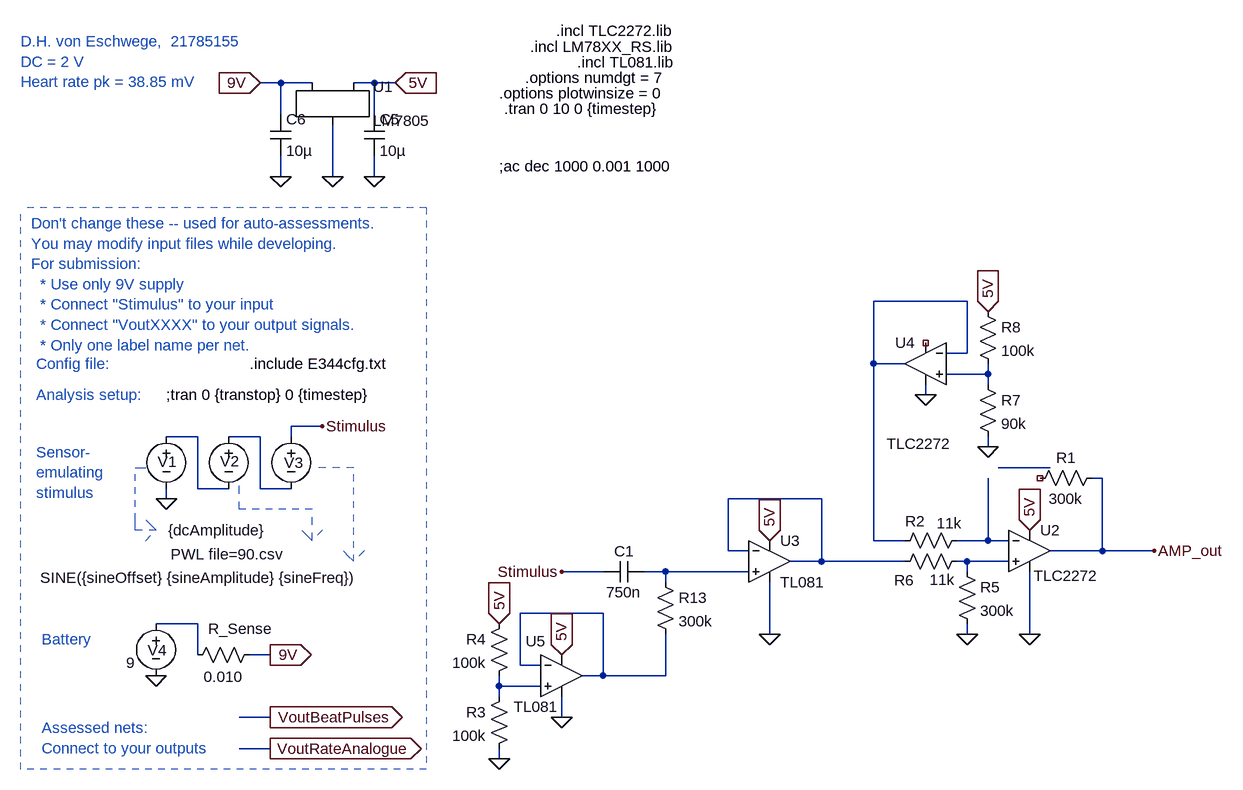
[diagram p0: schematic X_exp_2.asc]
X_exp_2.asc, the LTspice schematic file:
Version 4
SHEET 1 1824 680
WIRE -1904 -1600 -1936 -1600
WIRE -1856 -1600 -1904 -1600
WIRE -1760 -1600 -1792 -1600
WIRE -1728 -1600 -1760 -1600
WIRE -1904 -1552 -1904 -1600
WIRE -1760 -1552 -1760 -1600
WIRE -1904 -1456 -1904 -1488
WIRE -1824 -1456 -1824 -1536
WIRE -1760 -1456 -1760 -1488
WIRE -848 -1264 -992 -1264
WIRE -848 -1184 -848 -1264
WIRE -848 -1184 -880 -1184
WIRE -992 -1168 -992 -1264
WIRE -944 -1168 -992 -1168
WIRE -816 -1152 -816 -1168
WIRE -816 -1152 -880 -1152
WIRE -816 -1136 -816 -1152
WIRE -912 -1120 -912 -1136
WIRE -1840 -1072 -1888 -1072
WIRE -2032 -1056 -2080 -1056
WIRE -1936 -1056 -1984 -1056
WIRE -1888 -1056 -1888 -1072
WIRE -816 -1040 -816 -1056
WIRE -720 -1008 -800 -1008
WIRE -640 -992 -656 -992
WIRE -2032 -976 -2032 -1056
WIRE -1984 -976 -2032 -976
WIRE -1936 -976 -1936 -1056
WIRE -1888 -976 -1936 -976
WIRE -2080 -960 -2080 -976
WIRE -1072 -960 -1216 -960
WIRE -992 -896 -992 -1168
WIRE -944 -896 -992 -896
WIRE -816 -896 -816 -992
WIRE -816 -896 -864 -896
WIRE -784 -896 -816 -896
WIRE -1216 -880 -1216 -960
WIRE -1184 -880 -1216 -880
WIRE -640 -880 -640 -992
WIRE -640 -880 -720 -880
WIRE -560 -880 -640 -880
WIRE -1072 -864 -1072 -960
WIRE -1072 -864 -1120 -864
WIRE -944 -864 -1072 -864
WIRE -848 -864 -864 -864
WIRE -784 -864 -848 -864
WIRE -1408 -848 -1472 -848
WIRE -1312 -848 -1344 -848
WIRE -1184 -848 -1312 -848
WIRE -848 -848 -848 -864
WIRE -1312 -832 -1312 -848
WIRE -1408 -784 -1536 -784
WIRE -2032 -768 -2096 -768
WIRE -1152 -752 -1152 -832
WIRE -848 -752 -848 -768
WIRE -752 -752 -752 -848
WIRE -2032 -720 -2032 -768
WIRE -1920 -720 -1952 -720
WIRE -1536 -704 -1536 -784
WIRE -1504 -704 -1536 -704
WIRE -1408 -688 -1408 -784
WIRE -1408 -688 -1440 -688
WIRE -1312 -688 -1312 -752
WIRE -1312 -688 -1408 -688
WIRE -1568 -672 -1568 -688
WIRE -1504 -672 -1568 -672
WIRE -1568 -656 -1568 -672
WIRE -1920 -624 -1968 -624
WIRE -1472 -624 -1472 -656
WIRE -1920 -576 -1968 -576
WIRE -1568 -560 -1568 -576
FLAG -2080 -960 0
FLAG -1840 -1072 Stimulus
FLAG -1920 -720 9V
IOPIN -1920 -720 Out
FLAG -2096 -688 0
FLAG -1920 -624 VoutBeatPulses
IOPIN -1920 -624 Out
FLAG -1920 -576 VoutRateAnalogue
IOPIN -1920 -576 Out
FLAG -1824 -1456 0
FLAG -1152 -752 0
FLAG -1936 -1600 9V
IOPIN -1936 -1600 In
FLAG -1904 -1456 0
FLAG -1760 -1456 0
FLAG -1728 -1600 5V
IOPIN -1728 -1600 In
FLAG -1152 -896 5V
IOPIN -1152 -896 In
FLAG -1568 -560 0
FLAG -1568 -768 5V
IOPIN -1568 -768 In
FLAG -1472 -624 0
FLAG -1472 -720 5V
IOPIN -1472 -720 In
FLAG -1472 -848 Stimulus
FLAG -752 -752 0
FLAG -848 -752 0
FLAG -816 -1040 0
FLAG -816 -1248 5V
IOPIN -816 -1248 In
FLAG -752 -912 5V
IOPIN -752 -912 In
FLAG -560 -880 AMP_out
FLAG -912 -1120 0
SYMBOL voltage -1984 -1072 R0
WINDOW 123 0 0 Left 0
WINDOW 39 0 0 Left 0
WINDOW 3 -89 197 Left 2
WINDOW 0 -13 54 Left 2
SYMATTR Value PWL file=90.csv
SYMATTR InstName V2
SYMBOL voltage -1888 -1072 R0
WINDOW 123 24 44 Left 2
WINDOW 39 0 0 Left 0
WINDOW 3 -386 233 Left 2
WINDOW 0 -11 56 Left 2
SYMATTR Value SINE({sineOffset} {sineAmplitude} {sineFreq})
SYMATTR InstName V3
SYMBOL voltage -2080 -1072 R0
WINDOW 123 0 0 Left 0
WINDOW 39 0 0 Left 0
WINDOW 3 3 160 Left 2
WINDOW 0 -13 55 Left 2
SYMATTR Value {dcAmplitude}
SYMATTR InstName V1
SYMBOL voltage -2096 -784 R0
WINDOW 123 24 44 Left 2
WINDOW 39 0 0 Left 0
WINDOW 3 -46 76 Left 2
WINDOW 0 -13 57 Left 2
SYMATTR Value 9
SYMATTR InstName V4
SYMBOL res -1936 -736 R90
WINDOW 0 -9 30 VBottom 2
WINDOW 3 34 56 VTop 2
SYMATTR InstName R_Sense
SYMATTR Value 0.010
SYMBOL LM7805 -1824 -1584 R0
SYMATTR InstName U1
SYMBOL Opamps\\opamp2 -1152 -928 R0
SYMATTR InstName U3
SYMATTR Value TL081
SYMBOL cap -1776 -1552 R0
SYMATTR InstName C5
SYMATTR Value 10µ
SYMBOL cap -1920 -1552 R0
SYMATTR InstName C6
SYMATTR Value 10µ
SYMBOL cap -1344 -864 R90
WINDOW 0 0 32 VBottom 2
WINDOW 3 32 32 VTop 2
SYMATTR InstName C1
SYMATTR Value 750n
SYMBOL res -1552 -672 M0
SYMATTR InstName R3
SYMATTR Value 100k
SYMBOL res -1552 -784 M0
SYMATTR InstName R4
SYMATTR Value 100k
SYMBOL Opamps\\opamp2 -1472 -752 R0
WINDOW 0 -55 11 Left 2
WINDOW 3 -74 112 Left 2
SYMATTR InstName U5
SYMATTR Value TL081
SYMBOL res -1328 -848 R0
SYMATTR InstName R13
SYMATTR Value 300k
SYMBOL res -640 -1008 R90
WINDOW 0 0 56 VBottom 2
WINDOW 3 32 56 VTop 2
SYMATTR InstName R1
SYMATTR Value 300k
SYMBOL res -848 -912 R90
WINDOW 0 2 80 VBottom 2
WINDOW 3 -26 27 VTop 2
SYMATTR InstName R2
SYMATTR Value 11k
SYMBOL Opamps\\opamp2 -752 -944 R0
WINDOW 3 6 102 Left 2
SYMATTR Value TLC2272
SYMATTR InstName U2
SYMBOL res -864 -864 R0
SYMATTR InstName R5
SYMATTR Value 300k
SYMBOL res -848 -880 R90
WINDOW 0 61 97 VBottom 2
WINDOW 3 29 38 VTop 2
SYMATTR InstName R6
SYMATTR Value 11k
SYMBOL res -832 -1152 R0
SYMATTR InstName R7
SYMATTR Value 90k
SYMBOL res -832 -1264 R0
SYMATTR InstName R8
SYMATTR Value 100k
SYMBOL Opamps\\opamp2 -912 -1232 M0
WINDOW 3 -40 187 Left 2
SYMATTR Value TLC2272
SYMATTR InstName U4
TEXT -2080 -1120 Left 2 !;tran 0 {transtop} 0 {timestep}
TEXT -1952 -1168 Left 2 !.include E344cfg.txt
TEXT -2288 -1384 Left 2 ;Don't change these -- used for auto-assessments.\nYou may modify input files while developing.\nFor submission: \n  * Use only 9V supply \n  * Connect "Stimulus" to your input\n  * Connect "VoutXXXX" to your output signals.\n  * Only one label name per net.
TEXT -2280 -1168 Left 2 ;Config file:
TEXT -2280 -1120 Left 2 ;Analysis setup:
TEXT -2272 -744 Left 2 ;Battery
TEXT -2280 -1032 Left 2 ;Sensor-\nemulating \nstimulus
TEXT -2272 -608 Left 2 ;Assessed nets:\nConnect to your outputs
TEXT -2304 -1664 Left 2 ;D.H. von Eschwege,  21785155\nDC = 2 V\nHeart rate pk = 38.85 mV
TEXT -1480 -1680 Left 2 !.incl TLC2272.lib
TEXT -1520 -1656 Left 2 !.incl LM78XX_RS.lib
TEXT -1448 -1632 Left 2 !.incl TL081.lib
TEXT -1528 -1608 Left 2 !.options numdgt = 7
TEXT -1568 -1584 Left 2 !.options plotwinsize = 0
TEXT -1568 -1472 Left 2 !;ac dec 1000 0.001 1000
TEXT -1560 -1560 Left 2 !.tran 0 10 0 {timestep}
LINE Normal -1792 -1008 -1856 -1008 2
LINE Normal -1792 -864 -1792 -1008 2
LINE Normal -1808 -880 -1792 -864 2
LINE Normal -1792 -864 -1808 -880 2
LINE Normal -1776 -880 -1792 -864 2
LINE Normal -2128 -1008 -2112 -1008 2
LINE Normal -2128 -928 -2128 -1008 2
LINE Normal -2128 -912 -2128 -928 2
LINE Normal -2096 -912 -2128 -912 2
LINE Normal -2112 -928 -2096 -912 2
LINE Normal -2096 -912 -2112 -928 2
LINE Normal -2112 -896 -2096 -912 2
LINE Normal -1968 -944 -1968 -992 2
LINE Normal -1856 -944 -1968 -944 2
LINE Normal -1856 -896 -1856 -944 2
LINE Normal -1872 -912 -1856 -896 2
LINE Normal -1856 -896 -1872 -912 2
LINE Normal -1840 -912 -1856 -896 2
LINE Normal -2304 -544 -2304 -1408 1
LINE Normal -1680 -1408 -1680 -544 1
LINE Normal -1680 -544 -2304 -544 1
LINE Normal -1680 -1408 -2304 -1408 1

The netlist it stands for:
* X_exp_2.asc
V2 N004 N003 PWL file=90.csv
V3 Stimulus N004 SINE({sineOffset} {sineAmplitude} {sineFreq})
V1 N003 0 {dcAmplitude}
V4 N011 0 9
R_Sense 9V N011 0.010
XU1 9V 0 5V LM7805
XU3 N009 N006 5V 0 N006 TL081  ; pins In+ In- V+ V- OUT
C5 5V 0 10µ
C6 9V 0 10µ
C1 N009 Stimulus 750n
R3 N012 0 100k
R4 5V N012 100k
XU5 N012 N010 5V 0 N010 TL081  ; pins In+ In- V+ V- OUT
R13 N009 N010 300k
R1 AMP_out NC_01 300k
R2 N007 N001 11k
XU2 N008 N007 5V 0 AMP_out TLC2272  ; pins In+ In- V+ V- OUT
R5 N008 0 300k
R6 N008 N006 11k
R7 N002 0 90k
R8 5V N002 100k
XU4 N002 N001 NC_02 0 N001 TLC2272  ; pins In+ In- V+ V- OUT
;tran 0 {transtop} 0 {timestep}
.include E344cfg.txt
* Don't change these -- used for auto-assessments.
* You may modify input files while developing.
* For submission:
*   * Use only 9V supply
*   * Connect "Stimulus" to your input
*   * Connect "VoutXXXX" to your output signals.
*   * Only one label name per net.
* Config file:
* Analysis setup:
* Battery
* Sensor-
* emulating
* stimulus
* Assessed nets:
* Connect to your outputs
* D.H. von Eschwege,  21785155
* DC = 2 V
* Heart rate pk = 38.85 mV
.incl TLC2272.lib
.incl LM78XX_RS.lib
.incl TL081.lib
.options numdgt = 7
.options plotwinsize = 0
;ac dec 1000 0.001 1000
.tran 0 10 0 {timestep}
.backanno
.end